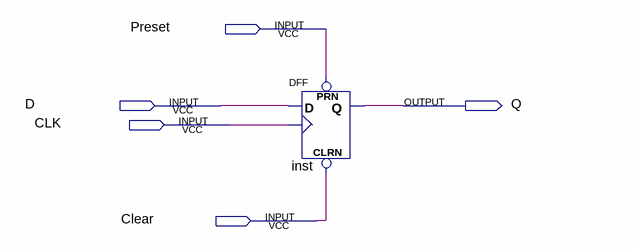
[diagram p0: schematic sheet]
// Quartus schematic Task1.bdf as structural Verilog: 1 symbols, 5 pins
module Task1 (
  input  Preset,
  input  D,
  input  CLK,
  input  Clear,
  output Q
);

  DFF inst (.CLRN(Clear), .CLK(CLK), .D(D), .PRN(Preset), .Q(Q));
endmodule
